# EasyEDA schematic SENSOR_SCH_HDMI.json
TITLE: DRONE_SENSOR_SHIELD_HDMI; REV: 2.0; Date: 17-11-2023; Sheet: 1/1; Drawn By: J.Rainey; Company: QUB
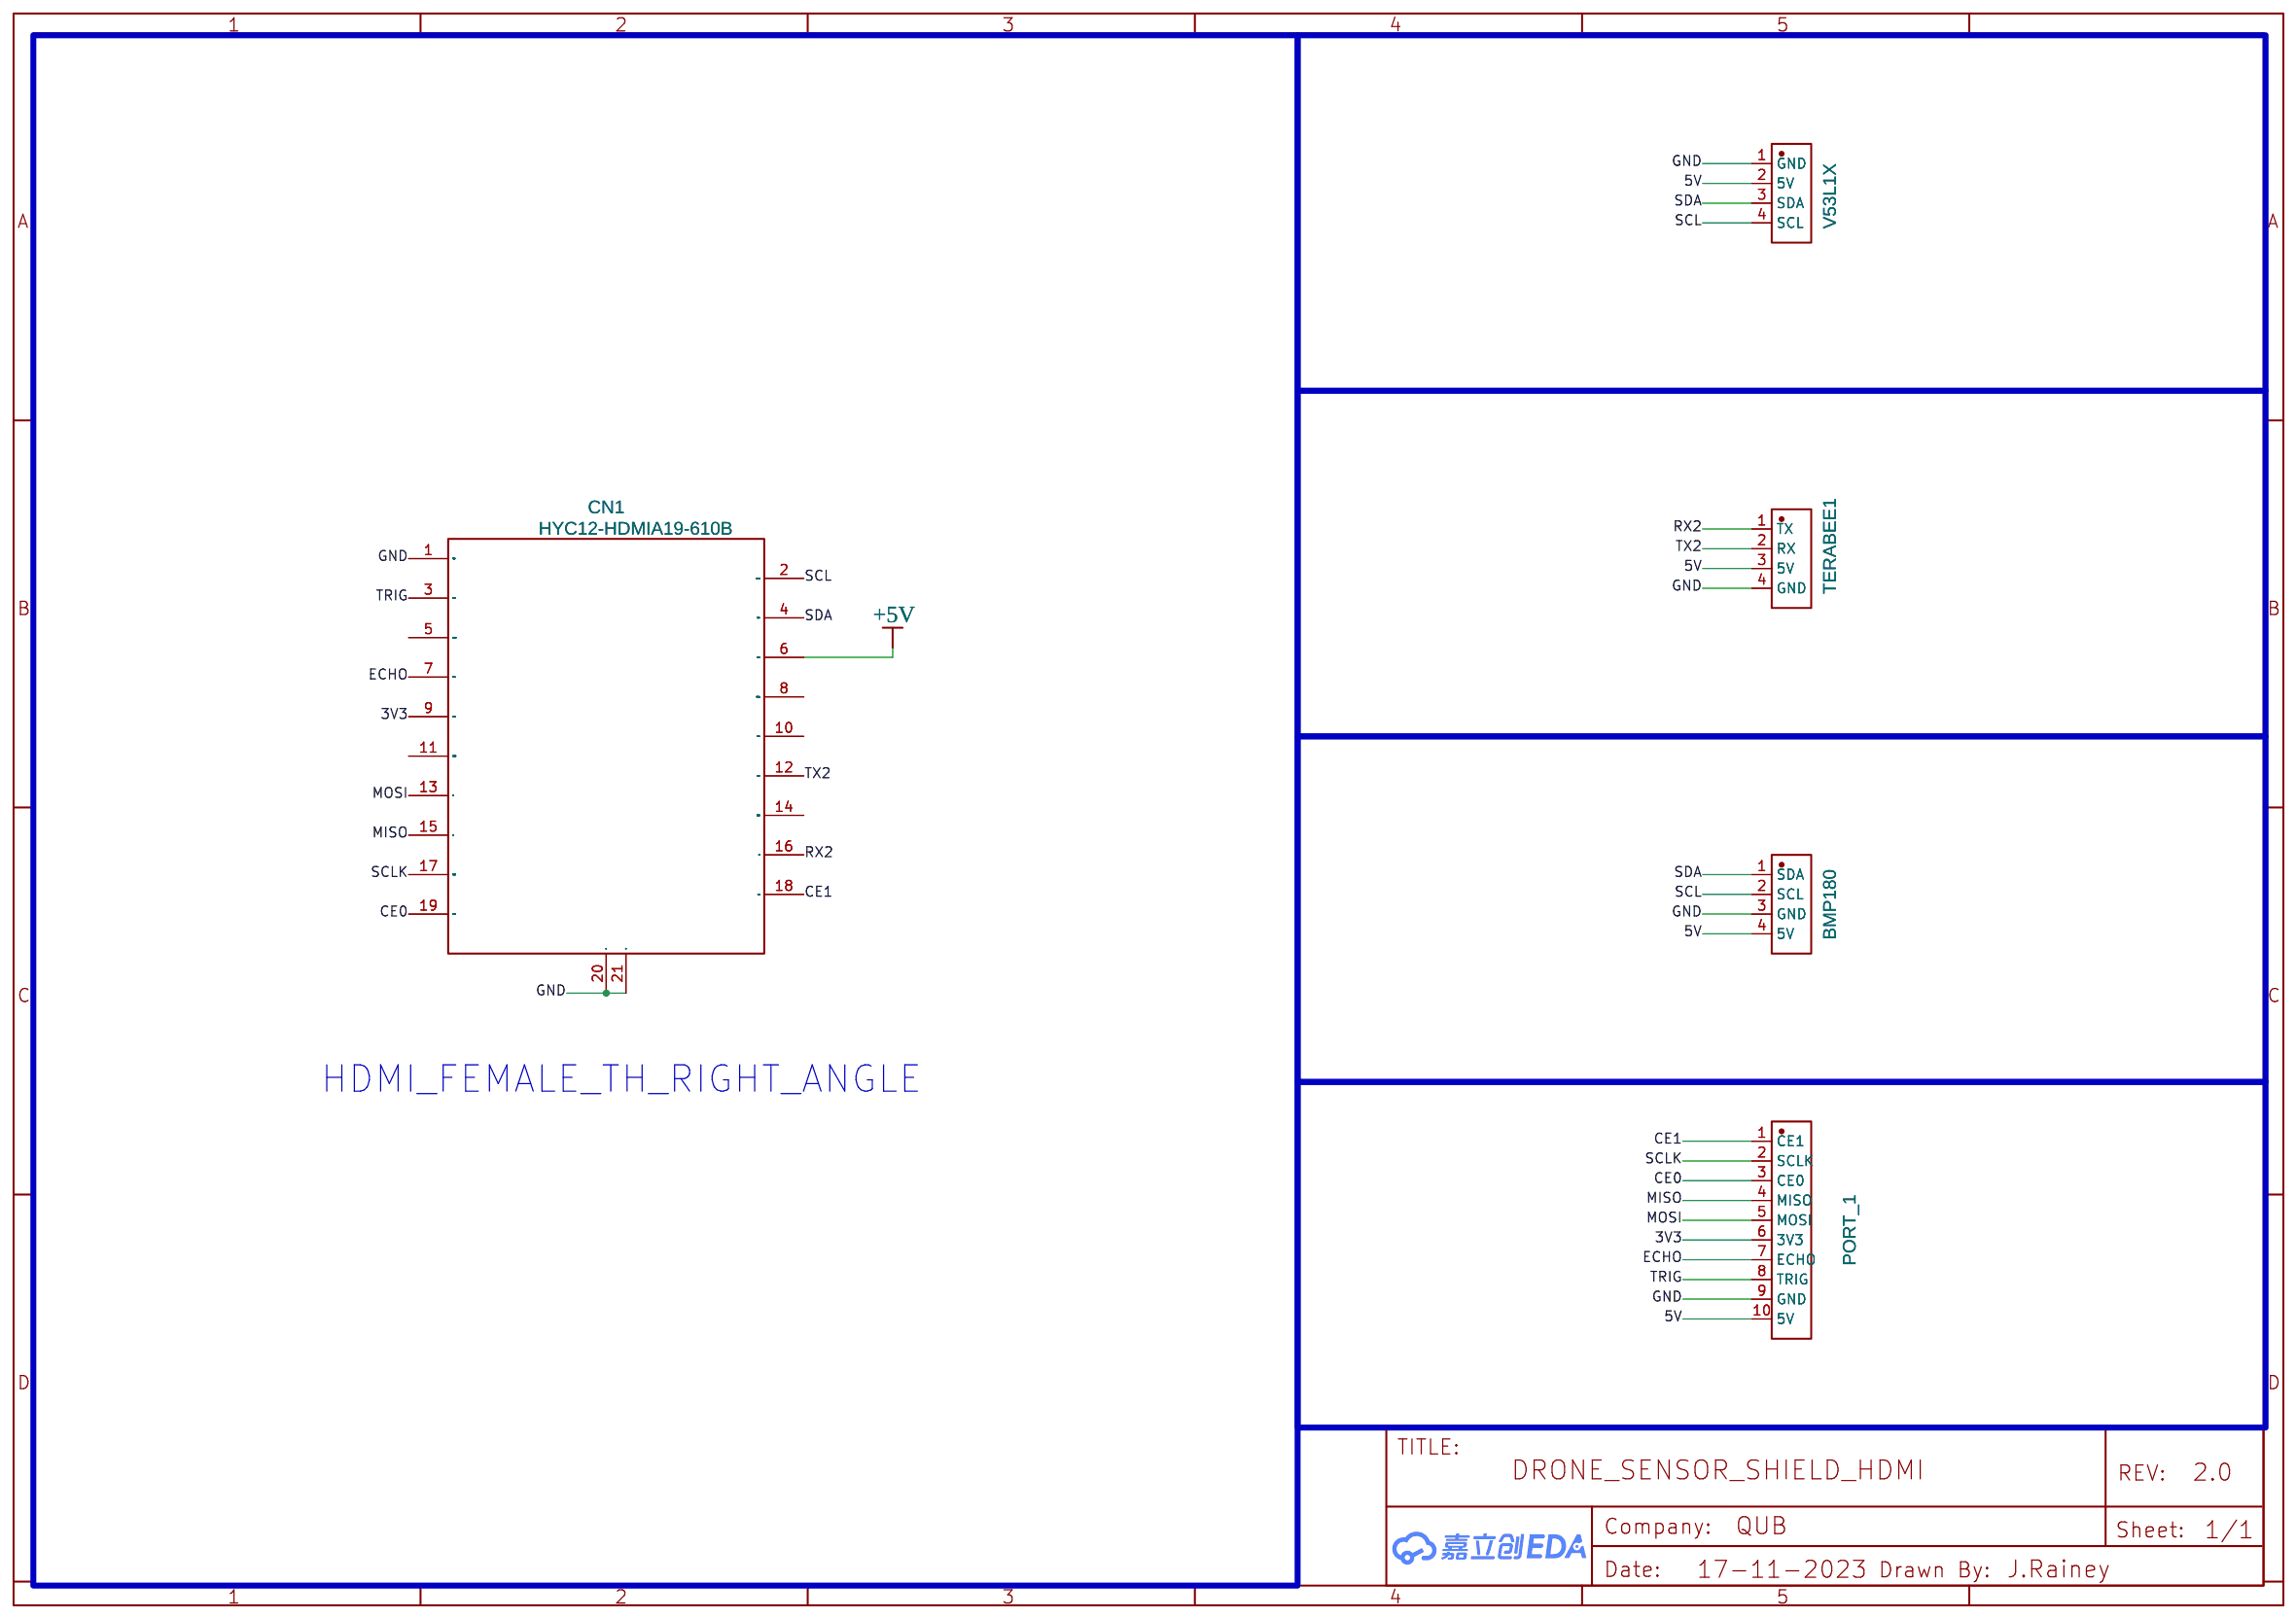
[diagram p0: schematic sheet]

## Parts
BMP180  PZ254V-11-04P  [HDR-TH_4P-P2.54-V-M]
CN1  HYC12-HDMIA19-610B  [HDMI-TH_HYC12-HDMIA19-61]
PORT_1  PORT_1  [HDR-TH_10P-P2.54-V-F]
TERABEE1  PZ254V-11-04P  [HDR-TH_4P-P2.54-V-M]
V53L1X  PZ254V-11-04P  [HDR-TH_4P-P2.54-V-M]

## Library data of the parts
BMP180 TERABEE1 V53L1X = PZ254V-11-04P: Supplier: LCSC; Supplier Part: C492403; Manufacturer: XFCN; Contributor: vatsal patel; JLCPCB Part Class: Extended Part
CN1 = HYC12-HDMIA19-610B: Supplier: LCSC; Supplier Part: C711354; Manufacturer: 华宇创; Contributor: LCSC; JLCPCB Part Class: Extended Part
PORT_1 = CN10_2R54_10X1: Contributor: LCSC; Supplier: LCSC; Supplier Part: C9900001415; JLCPCB Part Class: Extended Part

## Nets
3V3: CN1.9(TMDS Data 0-) PORT_1.6(3V3)
5V: BMP180.4(5V) PORT_1.10(5V) TERABEE1.3(5V) V53L1X.2(5V)
+5V: CN1.6(TMDS Data 1-)
GND: BMP180.3(GND) CN1.1(TMDS Data 2+) CN1.20(EH) CN1.21(EH) PORT_1.9(GND) TERABEE1.4(GND) V53L1X.1(GND)
CE0: CN1.19(Hot Plug Detect) PORT_1.3(CE0)
CE1: CN1.18(+5V Power) PORT_1.1(CE1)
ECHO: CN1.7(TMDS Data 0+) PORT_1.7(ECHO)
MISO: CN1.15(SCL) PORT_1.4(MISO)
MOSI: CN1.13(CEC) PORT_1.5(MOSI)
RX2: CN1.16(SDA) TERABEE1.1(TX)
SCL: BMP180.2(SCL) CN1.2(TMDS Data 2 Shield) V53L1X.4(SCL)
SCLK: CN1.17(DDC/CEC Ground) PORT_1.2(SCLK)
SDA: BMP180.1(SDA) CN1.4(TMDS Data 1+) V53L1X.3(SDA)
TRIG: CN1.3(TMDS Data 2-) PORT_1.8(TRIG)
TX2: CN1.12(TMDS Clock-) TERABEE1.2(RX)

Not connected (* = marked no-connect by the designer): CN1 5(TMDS Data 1 Shield) 8(TMDS Data 0 Shield) 10(TMDS Clock+) 11(TMDS Clock Shield) 14(Reserved (N.C.))

## Notes on the sheet
- HDMI_FEMALE_TH_RIGHT_ANGLE
